# Altium schematic sheet Flow_sensor.SchDoc
size 420 x 297 mm; Address1: Address1; Address2: Address2; Address3: Address3; Address4: Address4; DocumentNumber: *Э3; SheetNumber: 11; SheetTotal: 11; DocumentType: Схема электрическая *
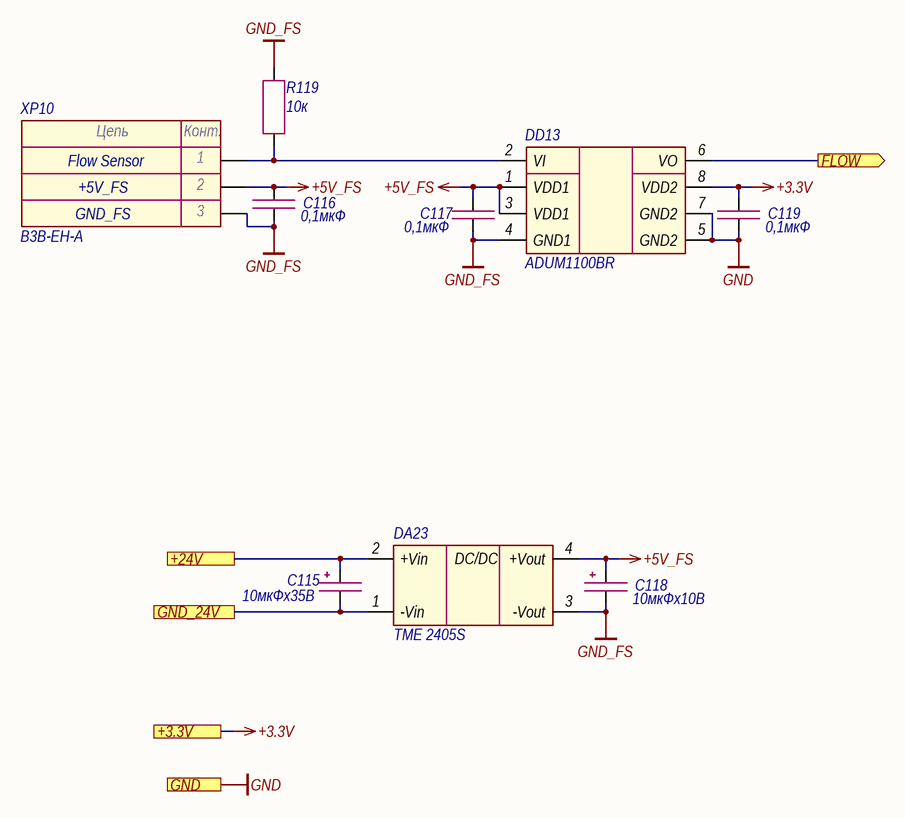
[diagram p0: Flow_sensor.SchDoc]

## Parts
C115  10мкФх35B  [CAP_C]
C116  0,1мкФ  [CAP_0603]
C117  0,1мкФ  [CAP_0603]
C118  10мкФх10B  [CAP_A]
C119  0,1мкФ  [CAP_0603]
DA23  TME 2405S  [TME (SIP-4)]
DD13  ADUM1100BR  [SOIC-8]
R119  10к  [RES_0603]
XP10  B3B-EH-A  [B3B-EH-A]

## Ports
+3.3V (see Main[3C], Ethernet[3D], Fiber_interlock[2C], Hardwiring[3D], LD_driver[1D], Power_supply[1D]), +24V (see Main[2C], Hardwiring[3C], Indication[1C], LD_driver[1D], Power_supply[1D]), FLOW (out, see Main[3C]), GND (see Main[3C], Ethernet[3D], Fiber_interlock[2C], Guide_laser[1C], Hardwiring[3D], Indication[1C], LD_driver[1D], Power_supply[1D]), GND_24V (see Main[2C], Hardwiring[3C], Indication[1C], LD_driver[1D], Power_supply[1D])

## Nets
+3.3V: C119.1 DD13.8(VDD2) ; port +3.3V
+5V_FS: C116.1 C117.1 C118.1 DA23.4(+Vout) DD13.1(VDD1) DD13.3(VDD1) XP10.2
GND: C119.2 DD13.5(GND2) DD13.7(GND2) ; port GND
GND_FS: C116.2 C117.2 C118.2 DA23.3(-Vout) DD13.4(GND1) R119.2 XP10.3
+24V: C115.1 DA23.2(+Vin) ; port +24V
FLOW: DD13.6(VO) ; port FLOW
GND_24V: C115.2 DA23.1(-Vin) ; port GND_24V
NetDD13_2: DD13.2(VI) R119.1 XP10.1

## Notes on the sheet
- +5V_FS
- Flow Sensor
- GND_FS
- Подп. и дата
- Инв. № дубл.
- Взам. инв. №
- Инв. № подл.
- Изм.
- Лист
- № докум.
- Подп.
- Дата
- Копировал
- Формат А3
- (in symbol Connector-3) Цепь; Конт.
- (in symbol TME) DC/DC

## Library data of the parts
C115 = Capacitor_Polar: Model: TECAP, 10 мкФ, 35 В, тип C, 10%; Value: 10мкФх35B; Document: *; Manufacturer: *
C116 C117 C119 = Capacitor: Manufacturer: Murata; Model: GRM188R71H104KA93D; Value: 0,1мкФ; Document: *
C118 = Capacitor_Polar: Model: TECAP, 10 мкФ, 10 В, тип A, 10%; Value: 10мкФх10B; Document: *; Manufacturer: *
DA23 = TME: Manufacturer: Traco Power; Model: TME 2405S; Document: *
DD13 = ADUM1100: Manufacturer: Analog Devices; Model: ADUM1100BR; Document: *
R119 = Resistor: Manufacturer: Yageo; Model: RC0603FR-0710KL; Value: 10к; Document: *
XP10 = Connector-3: Manufacturer: JST; Model: B3B-EH-A; Document: *